# Altium schematic sheet LoRa.SchDoc
size A4; SheetNumber: 5; SheetTotal: 8
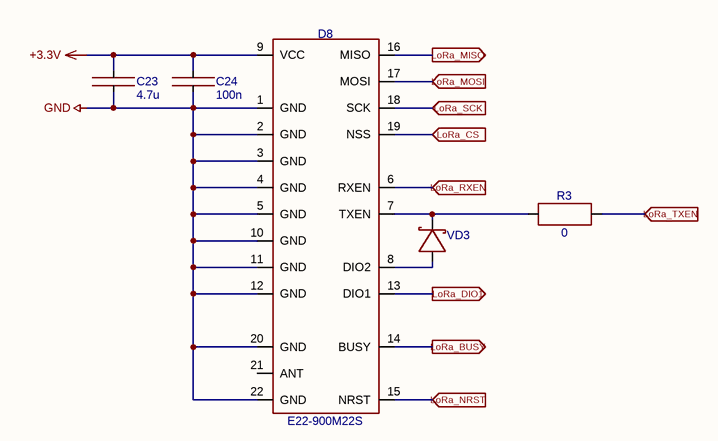
[diagram p0: LoRa.SchDoc]

## Parts
C23  4.7u  [CAPC1608X09N]
C24  100n  [CAPC1608X09N]
D8  E22-900M22S  [EBYTE E22]
R3  0  [RESC1608X05N]
VD3  BAR6402VH6327XTSA1  [INFENION SC79]  (value not drawn)

## Ports
LoRa_BUSY (out), LoRa_CS (in), LoRa_DIO1 (out), LoRa_MISO (out), LoRa_MOSI (in), LoRa_NRST (in), LoRa_RXEN (in), LoRa_SCK (in), LoRa_TXEN (in)

## Nets
+3.3V: C23.2 C24.2 D8.9(VCC)
GND: C23.1 C24.1 D8.1(GND) D8.2(GND) D8.3(GND) D8.4(GND) D8.5(GND) D8.10(GND) D8.11(GND) D8.12(GND) D8.20(GND) D8.22(GND)
LoRa_BUSY: D8.14(BUSY) ; port LoRa_BUSY
LoRa_CS: D8.19(NSS) ; port LoRa_CS
LoRa_DIO1: D8.13(DIO1) ; port LoRa_DIO1
LoRa_MISO: D8.16(MISO) ; port LoRa_MISO
LoRa_MOSI: D8.17(MOSI) ; port LoRa_MOSI
LoRa_NRST: D8.15(NRST) ; port LoRa_NRST
LoRa_RXEN: D8.6(RXEN) ; port LoRa_RXEN
LoRa_SCK: D8.18(SCK) ; port LoRa_SCK
LoRa_TXEN: R3.2 ; port LoRa_TXEN
NetD8_7: D8.7(TXEN) R3.1 VD3.1
NetD8_8: D8.8(DIO2) VD3.2

Not connected (* = marked no-connect by the designer): D8 21(ANT)

## Library data of the parts
C23 = C0603-4.7u-10V-X5R-10%: GRM188R61A475K
C24 = C0603-100n-25V-X7R-10%: GRM188R71E104KA01D
R3 = R-0603-0